# Altium schematic sheet RiscPC_VRAM.SchDoc
size A3; SheetNumber: 1; SheetTotal: 1
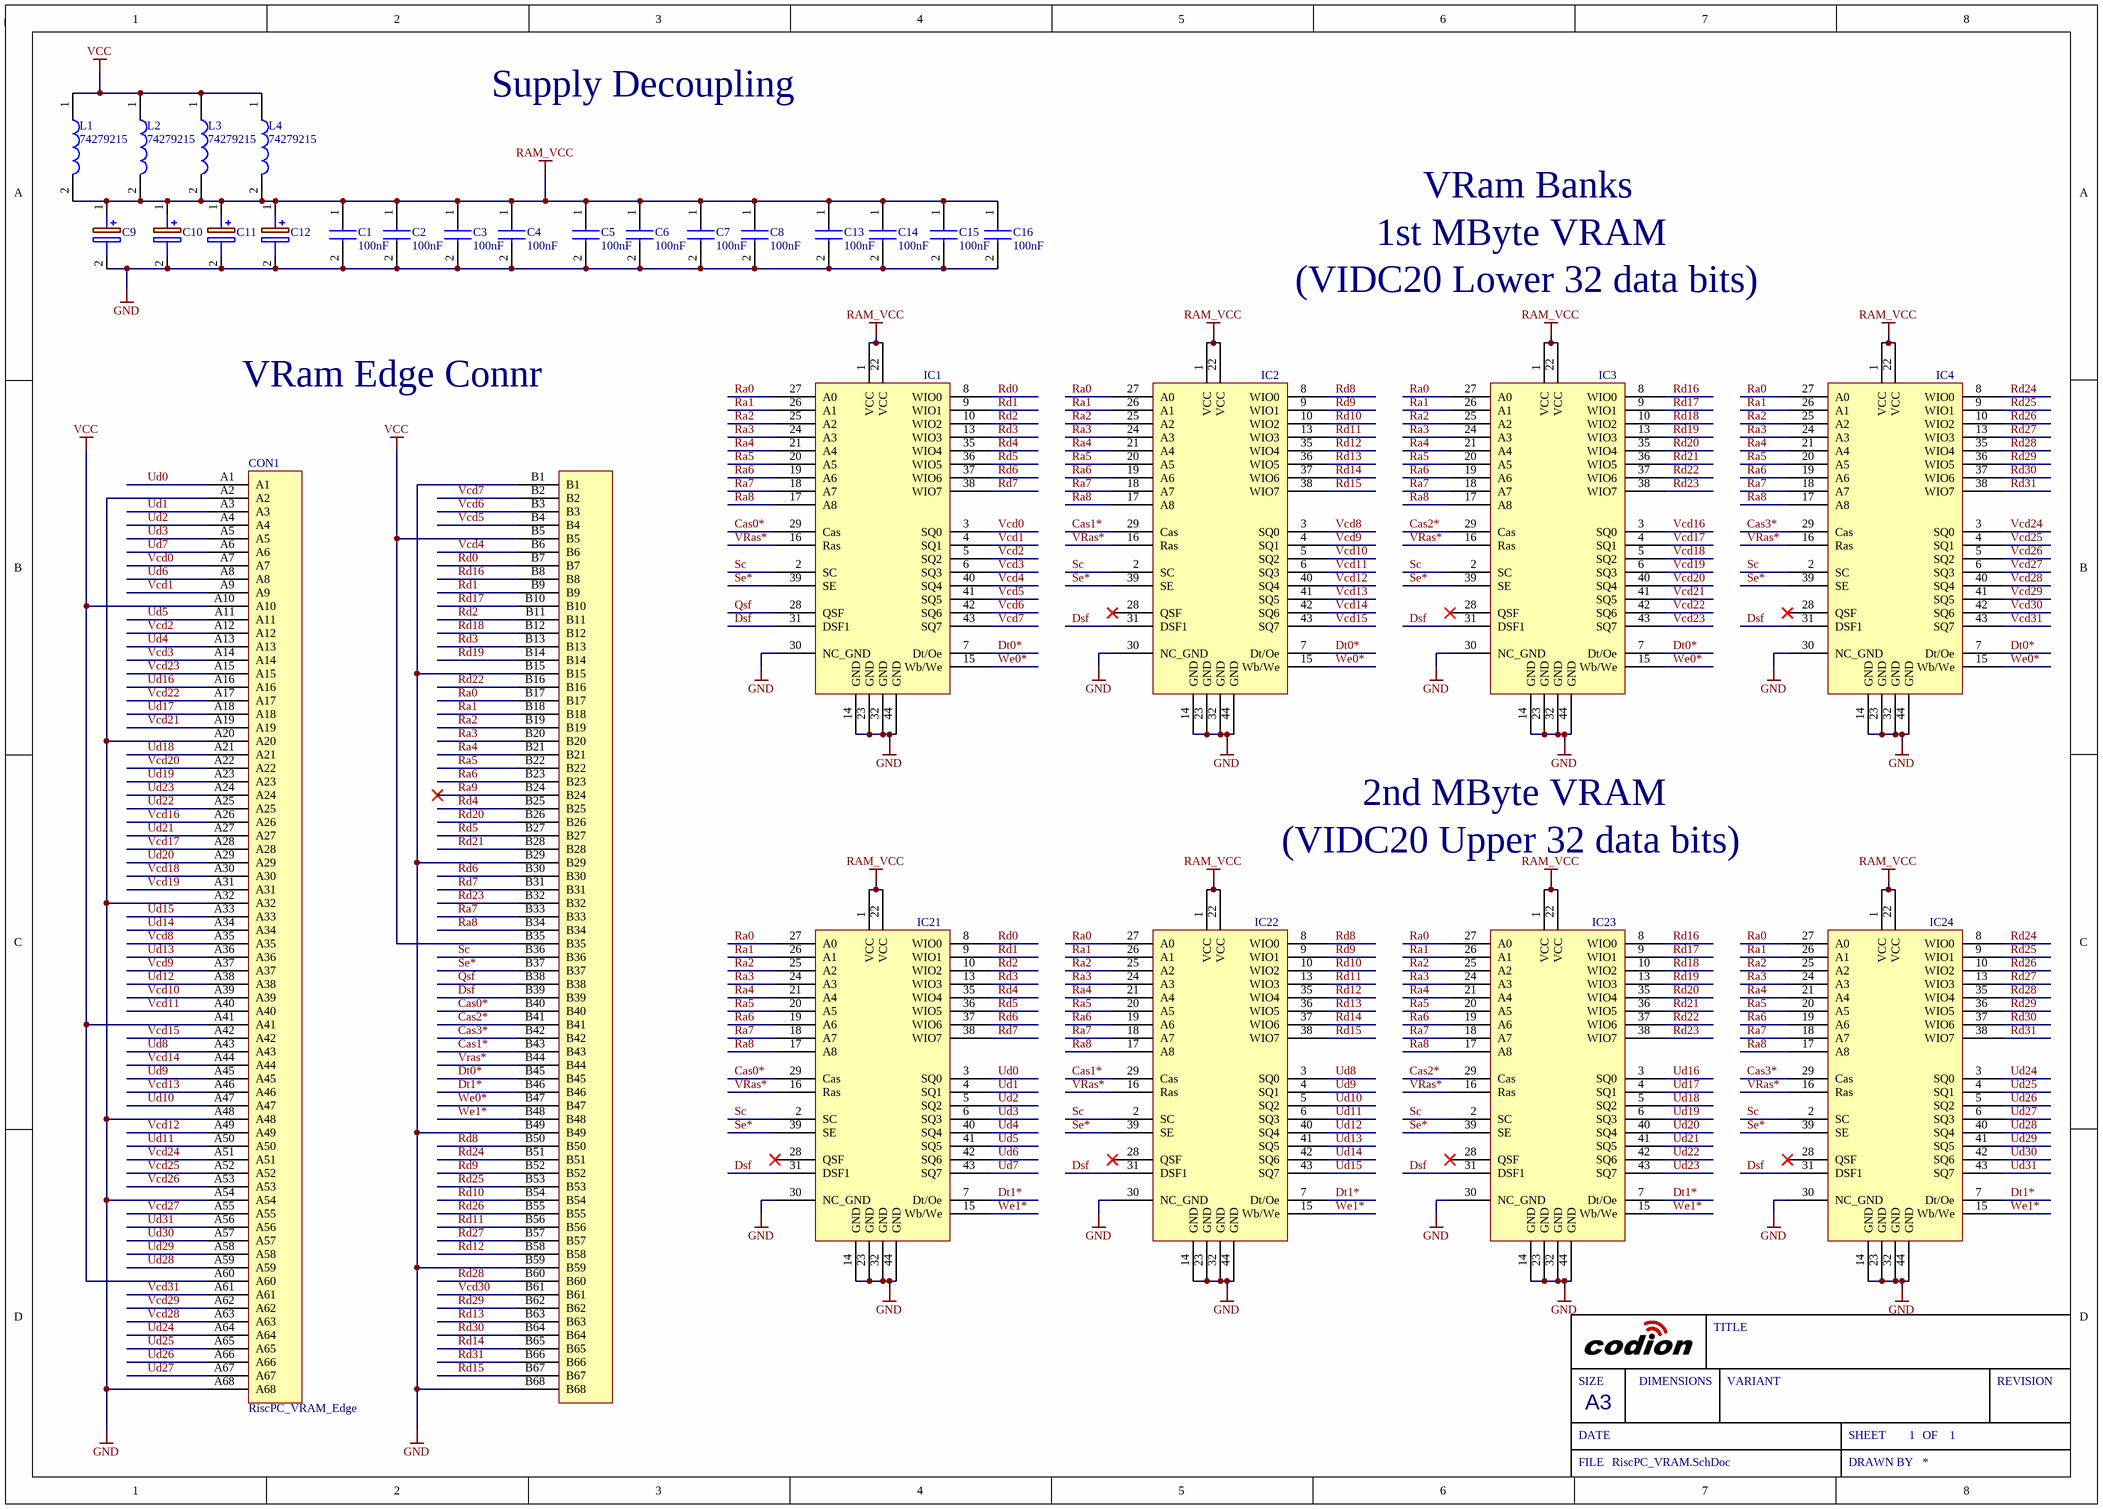
[diagram p0: RiscPC_VRAM.SchDoc]

## Parts
C1  100nF  [CAPC2012X145N]
C2  100nF  [CAPC2012X145N]
C3  100nF  [CAPC2012X145N]
C4  100nF  [CAPC2012X145N]
C5  100nF  [CAPC2012X145N]
C6  100nF  [CAPC2012X145N]
C7  100nF  [CAPC2012X145N]
C8  100nF  [CAPC2012X145N]
C9  EEE-HA1C470AP  [EEE1AA101SP]  (value not drawn)
C10  EEE-HA1C470AP  [EEE1AA101SP]  (value not drawn)
C11  EEE-HA1C470AP  [EEE1AA101SP]  (value not drawn)
C12  EEE-HA1C470AP  [EEE1AA101SP]  (value not drawn)
C13  100nF  [CAPC2012X145N]
C14  100nF  [CAPC2012X145N]
C15  100nF  [CAPC2012X145N]
C16  100nF  [CAPC2012X145N]
CON1  RiscPC_VRAM_Edge  [RiscPC_VRAM_Edge]
IC1  VRAM_256x8  [TSOP044-P-0400-1]  (value not drawn)
IC2  VRAM_256x8  [TSOP044-P-0400-1]  (value not drawn)
IC3  VRAM_256x8  [TSOP044-P-0400-1]  (value not drawn)
IC4  VRAM_256x8  [TSOP044-P-0400-1]  (value not drawn)
IC21  VRAM_256x8  [TSOP044-P-0400-1]  (value not drawn)
IC22  VRAM_256x8  [TSOP044-P-0400-1]  (value not drawn)
IC23  VRAM_256x8  [TSOP044-P-0400-1]  (value not drawn)
IC24  VRAM_256x8  [TSOP044-P-0400-1]  (value not drawn)
L1  74279215  [INDC3216X130N]
L2  74279215  [INDC3216X130N]
L3  74279215  [INDC3216X130N]
L4  74279215  [INDC3216X130N]

## Nets
GND: C1.2 C2.2 C3.2 C4.2 C5.2 C6.2 C7.2 C8.2 C9.2(-) C10.2(-) C11.2(-) C12.2(-) C13.2 C14.2 C15.2 C16.2 CON1.A2 CON1.A20 CON1.A32 CON1.A48 CON1.A54 CON1.A68 CON1.B1 CON1.B15 CON1.B29 CON1.B49 CON1.B59 CON1.B68 IC1.14(GND) IC1.23(GND) IC1.30(NC_GND) IC1.32(GND) IC1.44(GND) IC2.14(GND) IC2.23(GND) IC2.30(NC_GND) IC2.32(GND) IC2.44(GND) IC3.14(GND) IC3.23(GND) IC3.30(NC_GND) IC3.32(GND) IC3.44(GND) IC4.14(GND) IC4.23(GND) IC4.30(NC_GND) IC4.32(GND) IC4.44(GND) IC21.14(GND) IC21.23(GND) IC21.30(NC_GND) IC21.32(GND) IC21.44(GND) IC22.14(GND) IC22.23(GND) IC22.30(NC_GND) IC22.32(GND) IC22.44(GND) IC23.14(GND) IC23.23(GND) IC23.30(NC_GND) IC23.32(GND) IC23.44(GND) IC24.14(GND) IC24.23(GND) IC24.30(NC_GND) IC24.32(GND) IC24.44(GND)
RAM_VCC: C1.1 C2.1 C3.1 C4.1 C5.1 C6.1 C7.1 C8.1 C9.1(+) C10.1(+) C11.1(+) C12.1(+) C13.1 C14.1 C15.1 C16.1 IC1.1(VCC) IC1.22(VCC) IC2.1(VCC) IC2.22(VCC) IC3.1(VCC) IC3.22(VCC) IC4.1(VCC) IC4.22(VCC) IC21.1(VCC) IC21.22(VCC) IC22.1(VCC) IC22.22(VCC) IC23.1(VCC) IC23.22(VCC) IC24.1(VCC) IC24.22(VCC) L1.2 L2.2 L3.2 L4.2
VCC: CON1.A10 CON1.A41 CON1.A60 CON1.B5 CON1.B35 L1.1 L2.1 L3.1 L4.1
Cas0*: CON1.B40 IC1.29(Cas) IC21.29(Cas)
Cas1*: CON1.B43 IC2.29(Cas) IC22.29(Cas)
Cas2*: CON1.B41 IC3.29(Cas) IC23.29(Cas)
Cas3*: CON1.B42 IC4.29(Cas) IC24.29(Cas)
Dsf: CON1.B39 IC1.31(DSF1) IC2.31(DSF1) IC3.31(DSF1) IC4.31(DSF1) IC21.31(DSF1) IC22.31(DSF1) IC23.31(DSF1) IC24.31(DSF1)
Dt0*: CON1.B45 IC1.7(Dt/Oe) IC2.7(Dt/Oe) IC3.7(Dt/Oe) IC4.7(Dt/Oe)
Dt1*: CON1.B46 IC21.7(Dt/Oe) IC22.7(Dt/Oe) IC23.7(Dt/Oe) IC24.7(Dt/Oe)
Qsf: CON1.B38 IC1.28(QSF)
Ra0: CON1.B17 IC1.27(A0) IC2.27(A0) IC3.27(A0) IC4.27(A0) IC21.27(A0) IC22.27(A0) IC23.27(A0) IC24.27(A0)
Ra1: CON1.B18 IC1.26(A1) IC2.26(A1) IC3.26(A1) IC4.26(A1) IC21.26(A1) IC22.26(A1) IC23.26(A1) IC24.26(A1)
Ra2: CON1.B19 IC1.25(A2) IC2.25(A2) IC3.25(A2) IC4.25(A2) IC21.25(A2) IC22.25(A2) IC23.25(A2) IC24.25(A2)
Ra3: CON1.B20 IC1.24(A3) IC2.24(A3) IC3.24(A3) IC4.24(A3) IC21.24(A3) IC22.24(A3) IC23.24(A3) IC24.24(A3)
Ra4: CON1.B21 IC1.21(A4) IC2.21(A4) IC3.21(A4) IC4.21(A4) IC21.21(A4) IC22.21(A4) IC23.21(A4) IC24.21(A4)
Ra5: CON1.B22 IC1.20(A5) IC2.20(A5) IC3.20(A5) IC4.20(A5) IC21.20(A5) IC22.20(A5) IC23.20(A5) IC24.20(A5)
Ra6: CON1.B23 IC1.19(A6) IC2.19(A6) IC3.19(A6) IC4.19(A6) IC21.19(A6) IC22.19(A6) IC23.19(A6) IC24.19(A6)
Ra7: CON1.B33 IC1.18(A7) IC2.18(A7) IC3.18(A7) IC4.18(A7) IC21.18(A7) IC22.18(A7) IC23.18(A7) IC24.18(A7)
Ra8: CON1.B34 IC1.17(A8) IC2.17(A8) IC3.17(A8) IC4.17(A8) IC21.17(A8) IC22.17(A8) IC23.17(A8) IC24.17(A8)
Ra9: CON1.B24
Rd0: CON1.B7 IC1.8(WIO0) IC21.8(WIO0)
Rd1: CON1.B9 IC1.9(WIO1) IC21.9(WIO1)
Rd2: CON1.B11 IC1.10(WIO2) IC21.10(WIO2)
Rd3: CON1.B13 IC1.13(WIO3) IC21.13(WIO3)
Rd4: CON1.B25 IC1.35(WIO4) IC21.35(WIO4)
Rd5: CON1.B27 IC1.36(WIO5) IC21.36(WIO5)
Rd6: CON1.B30 IC1.37(WIO6) IC21.37(WIO6)
Rd7: CON1.B31 IC1.38(WIO7) IC21.38(WIO7)
Rd8: CON1.B50 IC2.8(WIO0) IC22.8(WIO0)
Rd9: CON1.B52 IC2.9(WIO1) IC22.9(WIO1)
Rd10: CON1.B54 IC2.10(WIO2) IC22.10(WIO2)
Rd11: CON1.B56 IC2.13(WIO3) IC22.13(WIO3)
Rd12: CON1.B58 IC2.35(WIO4) IC22.35(WIO4)
Rd13: CON1.B63 IC2.36(WIO5) IC22.36(WIO5)
Rd14: CON1.B65 IC2.37(WIO6) IC22.37(WIO6)
Rd15: CON1.B67 IC2.38(WIO7) IC22.38(WIO7)
Rd16: CON1.B8 IC3.8(WIO0) IC23.8(WIO0)
Rd17: CON1.B10 IC3.9(WIO1) IC23.9(WIO1)
Rd18: CON1.B12 IC3.10(WIO2) IC23.10(WIO2)
Rd19: CON1.B14 IC3.13(WIO3) IC23.13(WIO3)
Rd20: CON1.B26 IC3.35(WIO4) IC23.35(WIO4)
Rd21: CON1.B28 IC3.36(WIO5) IC23.36(WIO5)
Rd22: CON1.B16 IC3.37(WIO6) IC23.37(WIO6)
Rd23: CON1.B32 IC3.38(WIO7) IC23.38(WIO7)
Rd24: CON1.B51 IC4.8(WIO0) IC24.8(WIO0)
Rd25: CON1.B53 IC4.9(WIO1) IC24.9(WIO1)
Rd26: CON1.B55 IC4.10(WIO2) IC24.10(WIO2)
Rd27: CON1.B57 IC4.13(WIO3) IC24.13(WIO3)
Rd28: CON1.B60 IC4.35(WIO4) IC24.35(WIO4)
Rd29: CON1.B62 IC4.36(WIO5) IC24.36(WIO5)
Rd30: CON1.B64 IC4.37(WIO6) IC24.37(WIO6)
Rd31: CON1.B66 IC4.38(WIO7) IC24.38(WIO7)
Sc: CON1.B36 IC1.2(SC) IC2.2(SC) IC3.2(SC) IC4.2(SC) IC21.2(SC) IC22.2(SC) IC23.2(SC) IC24.2(SC)
Se*: CON1.B37 IC1.39(SE) IC2.39(SE) IC3.39(SE) IC4.39(SE) IC21.39(SE) IC22.39(SE) IC23.39(SE) IC24.39(SE)
Ud0: CON1.A1 IC21.3(SQ0)
Ud1: CON1.A3 IC21.4(SQ1)
Ud2: CON1.A4 IC21.5(SQ2)
Ud3: CON1.A5 IC21.6(SQ3)
Ud4: CON1.A13 IC21.40(SQ4)
Ud5: CON1.A11 IC21.41(SQ5)
Ud6: CON1.A8 IC21.42(SQ6)
Ud7: CON1.A6 IC21.43(SQ7)
Ud8: CON1.A43 IC22.3(SQ0)
Ud9: CON1.A45 IC22.4(SQ1)
Ud10: CON1.A47 IC22.5(SQ2)
Ud11: CON1.A50 IC22.6(SQ3)
Ud12: CON1.A38 IC22.40(SQ4)
Ud13: CON1.A36 IC22.41(SQ5)
Ud14: CON1.A34 IC22.42(SQ6)
Ud15: CON1.A33 IC22.43(SQ7)
Ud16: CON1.A16 IC23.3(SQ0)
Ud17: CON1.A18 IC23.4(SQ1)
Ud18: CON1.A21 IC23.5(SQ2)
Ud19: CON1.A23 IC23.6(SQ3)
Ud20: CON1.A29 IC23.40(SQ4)
Ud21: CON1.A27 IC23.41(SQ5)
Ud22: CON1.A25 IC23.42(SQ6)
Ud23: CON1.A24 IC23.43(SQ7)
Ud24: CON1.A64 IC24.3(SQ0)
Ud25: CON1.A65 IC24.4(SQ1)
Ud26: CON1.A66 IC24.5(SQ2)
Ud27: CON1.A67 IC24.6(SQ3)
Ud28: CON1.A59 IC24.40(SQ4)
Ud29: CON1.A58 IC24.41(SQ5)
Ud30: CON1.A57 IC24.42(SQ6)
Ud31: CON1.A56 IC24.43(SQ7)
Vcd0: CON1.A7 IC1.3(SQ0)
Vcd1: CON1.A9 IC1.4(SQ1)
Vcd2: CON1.A12 IC1.5(SQ2)
Vcd3: CON1.A14 IC1.6(SQ3)
Vcd4: CON1.B6 IC1.40(SQ4)
Vcd5: CON1.B4 IC1.41(SQ5)
Vcd6: CON1.B3 IC1.42(SQ6)
Vcd7: CON1.B2 IC1.43(SQ7)
Vcd8: CON1.A35 IC2.3(SQ0)
Vcd9: CON1.A37 IC2.4(SQ1)
Vcd10: CON1.A39 IC2.5(SQ2)
Vcd11: CON1.A40 IC2.6(SQ3)
Vcd12: CON1.A49 IC2.40(SQ4)
Vcd13: CON1.A46 IC2.41(SQ5)
Vcd14: CON1.A44 IC2.42(SQ6)
Vcd15: CON1.A42 IC2.43(SQ7)
Vcd16: CON1.A26 IC3.3(SQ0)
Vcd17: CON1.A28 IC3.4(SQ1)
Vcd18: CON1.A30 IC3.5(SQ2)
Vcd19: CON1.A31 IC3.6(SQ3)
Vcd20: CON1.A22 IC3.40(SQ4)
Vcd21: CON1.A19 IC3.41(SQ5)
Vcd22: CON1.A17 IC3.42(SQ6)
Vcd23: CON1.A15 IC3.43(SQ7)
Vcd24: CON1.A51 IC4.3(SQ0)
Vcd25: CON1.A52 IC4.4(SQ1)
Vcd26: CON1.A53 IC4.5(SQ2)
Vcd27: CON1.A55 IC4.6(SQ3)
Vcd28: CON1.A63 IC4.40(SQ4)
Vcd29: CON1.A62 IC4.41(SQ5)
Vcd30: CON1.B61 IC4.42(SQ6)
Vcd31: CON1.A61 IC4.43(SQ7)
Vras*: CON1.B44 IC1.16(Ras) IC2.16(Ras) IC3.16(Ras) IC4.16(Ras) IC21.16(Ras) IC22.16(Ras) IC23.16(Ras) IC24.16(Ras)
We0*: CON1.B47 IC1.15(Wb/We) IC2.15(Wb/We) IC3.15(Wb/We) IC4.15(Wb/We)
We1*: CON1.B48 IC21.15(Wb/We) IC22.15(Wb/We) IC23.15(Wb/We) IC24.15(Wb/We)

Not connected (* = marked no-connect by the designer): IC2 28(QSF)*; IC3 28(QSF)*; IC4 28(QSF)*; IC21 28(QSF)*; IC22 28(QSF)*; IC23 28(QSF)*; IC24 28(QSF)*

## Notes on the sheet
- Supply Decoupling
- VRam Banks
- (VIDC20 Lower 32 data bits)
- 1st MByte VRAM
- VRam Edge Connr
- (VIDC20 Upper 32 data bits)
- 2nd MByte VRAM
- SIZE
- DIMENSIONS
- TITLE
- VARIANT
- REVISION
- DATE
- A3
- SHEET
- OF
- FILE
- DRAWN BY

## Library data of the parts
C1-C8 C13-C16 = C2012X7R1H104K125AM: Capacitor; Manufacturer_Name: TDK; Datasheet Link: https://product.tdk.com/info/en/catalog/datasheets/mlcc_commercial_midvoltage_en.pdf; Height: 1.45mm; Manufacturer_Part_Number: C2012X7R1H104K125AM; Mouser Part Number: 810-C2012X7R1H104KT5; Mouser Price/Stock: https://www.mouser.com/Search/Refine.aspx?Keyword=810-C2012X7R1H104KT5; Arrow Part Number: C2012X7R1H104K125AM; Arrow Price/Stock: https://www.arrow.com/en/products/c2012x7r1h104k125am/tdk
C9-C12 = EEE-HA1C470AP: Capacitor Polarised; Manufacturer_Name: Panasonic; Datasheet Link: http://industrial.panasonic.com/cdbs/www-data/pdf/RDE0000/ABA0000C1148.pdf; Height: 7.8mm; Manufacturer_Part_Number: EEE-HA1C470AP; Mouser Part Number: 667-EEE-HA1C470AP; Mouser Price/Stock: https://www.mouser.co.uk/ProductDetail/Panasonic/EEE-HA1C470AP?qs=d1CqaRUMZD%2FL5qU1hDRerg%3D%3D; Arrow Part Number: EEE-HA1C470AP; Arrow Price/Stock: https://www.arrow.com/en/products/eeeha1c470ap/panasonic?utm_currency=USD&region=europe
L1-L4 = 74279215: Inductor; Manufacturer_Name: Wurth Elektronik; Datasheet Link: http://componentsearchengine.com/Datasheets/1/74279215.pdf; Height: 1.3mm; Manufacturer_Part_Number: 74279215; Mouser Part Number: 710-74279215; Mouser Price/Stock: https://www.mouser.co.uk/ProductDetail/Wurth-Elektronik/74279215?qs=5twSNpOB8IC%252BebnV0jQtuw%3D%3D